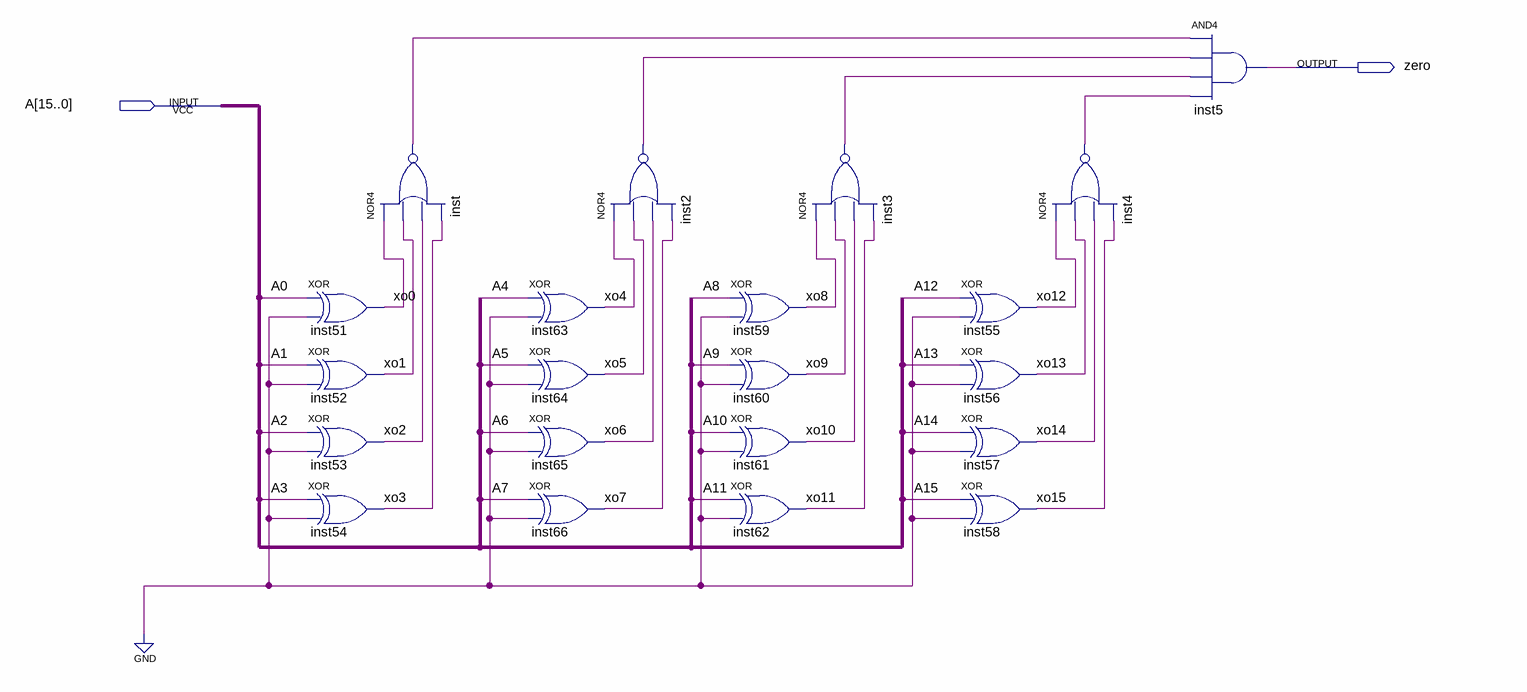
[diagram p0: schematic sheet]
// Quartus schematic check_zero.bdf as structural Verilog: 21 symbols, 2 pins
module check_zero (
  input  [15:0] A,
  output zero
);

  wire inst2_out, inst3_out, inst4_out, inst_out, xo0, xo1, xo2, xo3, xo4, xo5, xo6, xo7, xo8, xo9, xo10,
       xo11, xo12, xo13, xo14, xo15;

  xor inst51 (xo0, A[0], 1'b0);
  xor inst52 (xo1, A[1], 1'b0);
  xor inst53 (xo2, A[2], 1'b0);
  xor inst54 (xo3, A[3], 1'b0);
  nor inst (inst_out, xo0, xo1, xo2, xo3);
  xor inst63 (xo4, A[4], 1'b0);
  xor inst64 (xo5, A[5], 1'b0);
  xor inst65 (xo6, A[6], 1'b0);
  xor inst66 (xo7, A[7], 1'b0);
  nor inst2 (inst2_out, xo4, xo5, xo6, xo7);
  xor inst59 (xo8, A[8], 1'b0);
  xor inst60 (xo9, A[9], 1'b0);
  xor inst61 (xo10, A[10], 1'b0);
  xor inst62 (xo11, A[11], 1'b0);
  nor inst3 (inst3_out, xo8, xo9, xo10, xo11);
  xor inst55 (xo12, A[12], 1'b0);
  xor inst56 (xo13, A[13], 1'b0);
  xor inst57 (xo14, A[14], 1'b0);
  xor inst58 (xo15, A[15], 1'b0);
  nor inst4 (inst4_out, xo12, xo13, xo14, xo15);
  and inst5 (zero, inst_out, inst2_out, inst3_out, inst4_out);
endmodule
